# Altium schematic sheet dac.SchDoc
size 420 x 297 mm; Address1: Address1; Address2: Address2; Address3: Address3; Address4: Address4; DocumentNumber: АБВГ.123456.001 Э3; SheetNumber: 5; SheetTotal: 7; Scale: 1:1; DocumentType: Схема электрическая принципиальная; FirstReferrence: АБВГ.123456.001
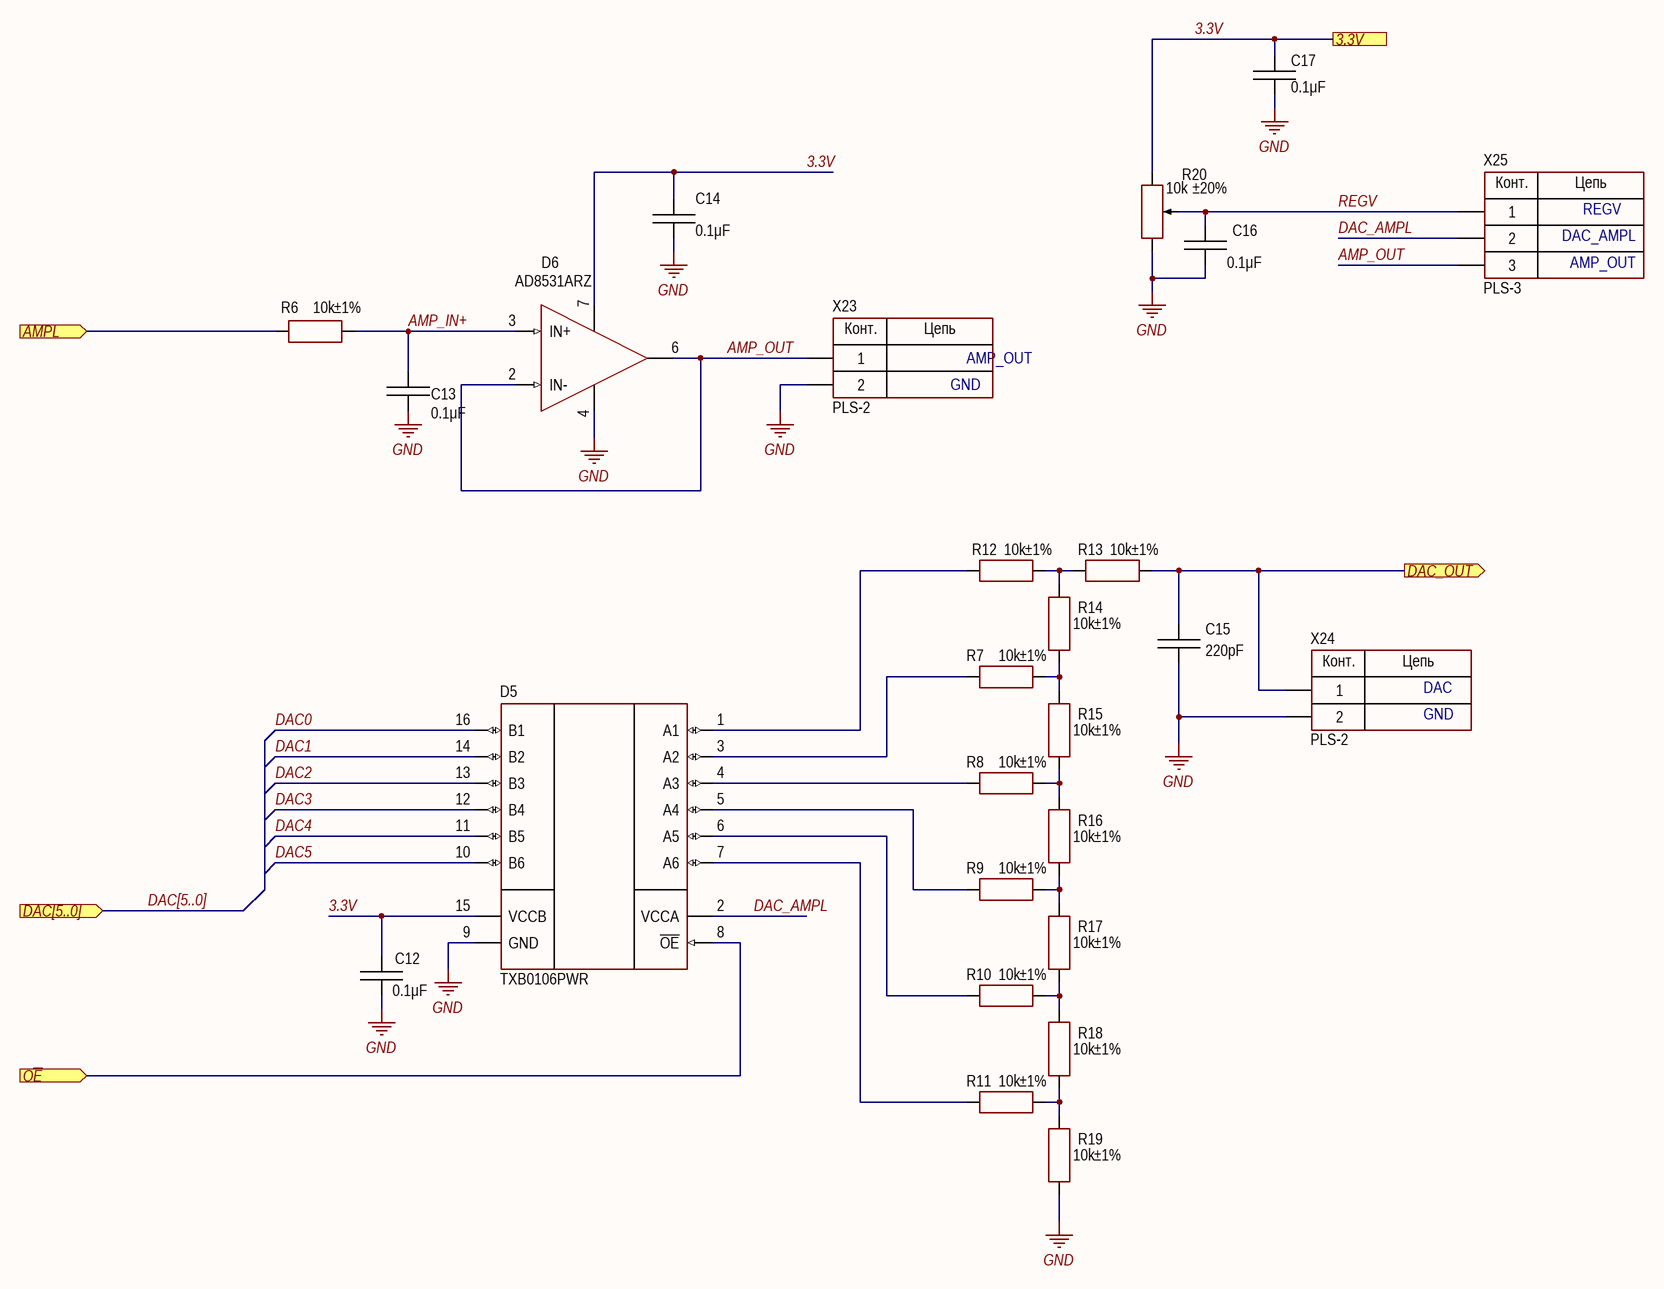
[diagram p0: dac.SchDoc]

## Parts
C12  value 0.1μF  [CAP: 1206]
C13  value 0.1μF  [CAP: 1206]
C14  value 0.1μF  [CAP: 1206]
C15  value 220pF  [CAP: 1206]
C16  value 0.1μF  [CAP: 1206]
C17  value 0.1μF  [CAP: 1206]
D5  (no value)  [16-TSSOP]
D6  (no value)  [8-SOIC]
R6  value 10k  Tolerance: ±1%  [RES: 1206]
R7  value 10k  Tolerance: ±1%  [RES: 1206]
R8  value 10k  Tolerance: ±1%  [RES: 1206]
R9  value 10k  Tolerance: ±1%  [RES: 1206]
R10  value 10k  Tolerance: ±1%  [RES: 1206]
R11  value 10k  Tolerance: ±1%  [RES: 1206]
R12  value 10k  Tolerance: ±1%  [RES: 1206]
R13  value 10k  Tolerance: ±1%  [RES: 1206]
R14  value 10k  Tolerance: ±1%  [RES: 1206]
R15  value 10k  Tolerance: ±1%  [RES: 1206]
R16  value 10k  Tolerance: ±1%  [RES: 1206]
R17  value 10k  Tolerance: ±1%  [RES: 1206]
R18  value 10k  Tolerance: ±1%  [RES: 1206]
R19  value 10k  Tolerance: ±1%  [RES: 1206]
R20  value 10k  Tolerance: ±20%  [RES: 3314G]
X23  (no value)  [CON: PLS-2]
X24  (no value)  [CON: PLS-2]
X25  (no value)  [CON: PLS-3]

## Ports
3.3V, AMPL (in), DAC[5..0] (in), DAC_OUT (out), O~{E} (in)

## Nets
GND: C12.1 C13.1 C14.1 C15.1 C16.1 C17.1 D5.9(GND) D6.4(V-) R19.2 R20.3 X23.2 X24.2
3.3V: C12.2 C14.2 C17.2 D5.15(VCCB) D6.7(V+) R20.1 ; port 3.3V
AMP_IN+: C13.2 D6.3(IN+) R6.1
AMP_OUT: D6.2(IN-) D6.6(OUT) X23.1 X25.3
AMPL: R6.2 ; port AMPL
DAC0: D5.16(B1)
DAC1: D5.14(B2)
DAC2: D5.13(B3)
DAC3: D5.12(B4)
DAC4: D5.11(B5)
DAC5: D5.10(B6)
DAC_AMPL: D5.2(VCCA) X25.2
DAC_OUT: C15.2 R13.1 X24.1 ; port DAC_OUT
O~{E}: D5.8(~{OE}) ; port O~{E}
REGV: C16.2 R20.2 X25.1
NetD5_1: D5.1(A1) R12.2
NetD5_3: D5.3(A2) R7.2
NetD5_4: D5.4(A3) R8.2
NetD5_5: D5.5(A4) R9.2
NetD5_6: D5.6(A5) R10.2
NetD5_7: D5.7(A6) R11.2
NetR7_1: R7.1 R14.2 R15.1
NetR8_1: R8.1 R15.2 R16.1
NetR9_1: R9.1 R16.2 R17.1
NetR10_1: R10.1 R17.2 R18.1
NetR11_1: R11.1 R18.2 R19.1
NetR12_1: R12.1 R13.2 R14.1

## Buses and harness runs
bus DAC[5..0] = port DAC[5..0]

## Notes on the sheet
- REGV
- DAC_AMPL
- AMP_OUT
- GND
- DAC
- Подп. и дата
- Инв. № дубл.
- Взам. инв. №
- Инв. № подл.
- Изм.
- Лист
- № докум.
- Подп.
- Дата
- 2.106-A3
- Копировал
- Формат А3
- (in symbol PLS-2) Конт.; Цепь
- (in symbol PLS-3) Конт.; Цепь

## Library data of the parts
C12-C14 C16 C17 = Ceramic_1206: Manufacturer: Murata Electronics; PartNumber: GRM319R71H104K; ValueManufacturerPartNumber: Ceramic capacitor, 0.1μF, X7R, ±10%, 50V, 1206, -55...+125°C; TypeCapacitor: Ceramic capacitor; Tolerance: ±10%; TypeDielectric: X7R; Voltage: 50V; Package: 1206; HelpURL: https://www.chipdip.ru/product/grm319r71h104k; Temperature: -55...+125°C
C15 = Ceramic_1206: Manufacturer: Yageo; PartNumber: CC1206KRX7R9BB104; ValueManufacturerPartNumber: Ceramic capacitor, 220pF, X7R, ±10%, 50V, 1206, -55...+125°C; TypeCapacitor: Ceramic capacitor; Tolerance: ±10%; TypeDielectric: X7R; Voltage: 50V; Package: 1206; HelpURL: https://www.digikey.com/product-detail/en/yageo/CC1206KRX7R9BB104/311-1179-1-ND/303089; Temperature: -55...+125°C
D5 = TXB0106PWR: 6-Bit Bidirectional Level-Shifting and Voltage Translator; Manufacturer: Texas Instruments; ValueManufacturerPartNumber: 6-Bit Bidirectional Level-Shifting and Voltage Translator, 1.2..3..6V   1.65..5.5V, -40...+85°C, 16-TSSOP; Supply: 1.2..3..6V   1.65..5.5V; HelpURL: https://www.chipdip.ru/product/txb0106pwr-2; Package: 16-TSSOP; ComponentType: 6-Bit Bidirectional Level-Shifting and Voltage Translator; Temperature: -40...+85°C; PartNumber: TXB0106PWR
D6 = AD8531ARZ: OP amplifier Rail-to-Rail 3MHz; Manufacturer: Analog Devices Inc.; ValueManufacturerPartNumber: IC op amplifier, Rail-to-Rail, 3MHz, 2.7V ~ 6V, ±1.35V ~3V, -40°C ~ 85°C, 8-SOIC; Supply: 2.7V ~ 6V, ±1.35V ~3V; Slew Rate: 3.5V/µs; HelpURL: https://www.chipdip.ru/product/ad8531arz; Package: 8-SOIC; ComponentType: IC op amplifier; Temperature: -40°C ~ 85°C; OutputType: Rail-to-Rail; GainBandwidth: 3MHz; PartNumber: AD8531ARZ
R6-R19 = Resistor_1206: Manufacturer: Yageo; PartNumber: RC1206JR-07100RL; ValueManufacturerPartNumber: Resistor film, 10k, ±1%, 1206, 0.25W, -55...+125°C; TypeResistor: Resistor film; Power: 0.25W; Package: 1206; HelpURL: https://www.digikey.com/product-detail/en/yageo/RC1206JR-07100RL/311-100ERCT-ND/732153; Temperature: -55...+125°C
R20 = Trimmer: Manufacturer: Bourns; PartNumber: 3314G-1-103E; Power: 0.25W; Package: 3314G; HelpURL: https://www.chipdip.ru/product/3314g-1-103e; ValueManufacturerPartNumber: =TypeResistor+', '+Value+', '+Tolerance+', '+Package+', '+Power+', '+Temperature; Temperature: -55...+125°C
X23 X24 = PLS-2: Manufacturer: Connfly; ValueManufacturerPartNumber: Connector, 2pin, 2.54mm, 500VAC, 3A; TypeConnector: Connector; VoltageMax: 500VAC; Pitch: 2.54mm; CurrentMax: 3A; Multichannel: 2pin; HelpURL: https://www.chipdip.ru/product/pls-2; PartNumber: PLS-2; CommentText: PLS-2
X25 = PLS-3: Manufacturer: Connfly; ValueManufacturerPartNumber: Connector, 3pin, 2.54mm, 500VAC, 3A; TypeConnector: Connector; VoltageMax: 500VAC; Pitch: 2.54mm; CurrentMax: 3A; Multichannel: 3pin; HelpURL: https://www.chipdip.ru/product/pls-3; PartNumber: PLS-3; CommentText: PLS-3